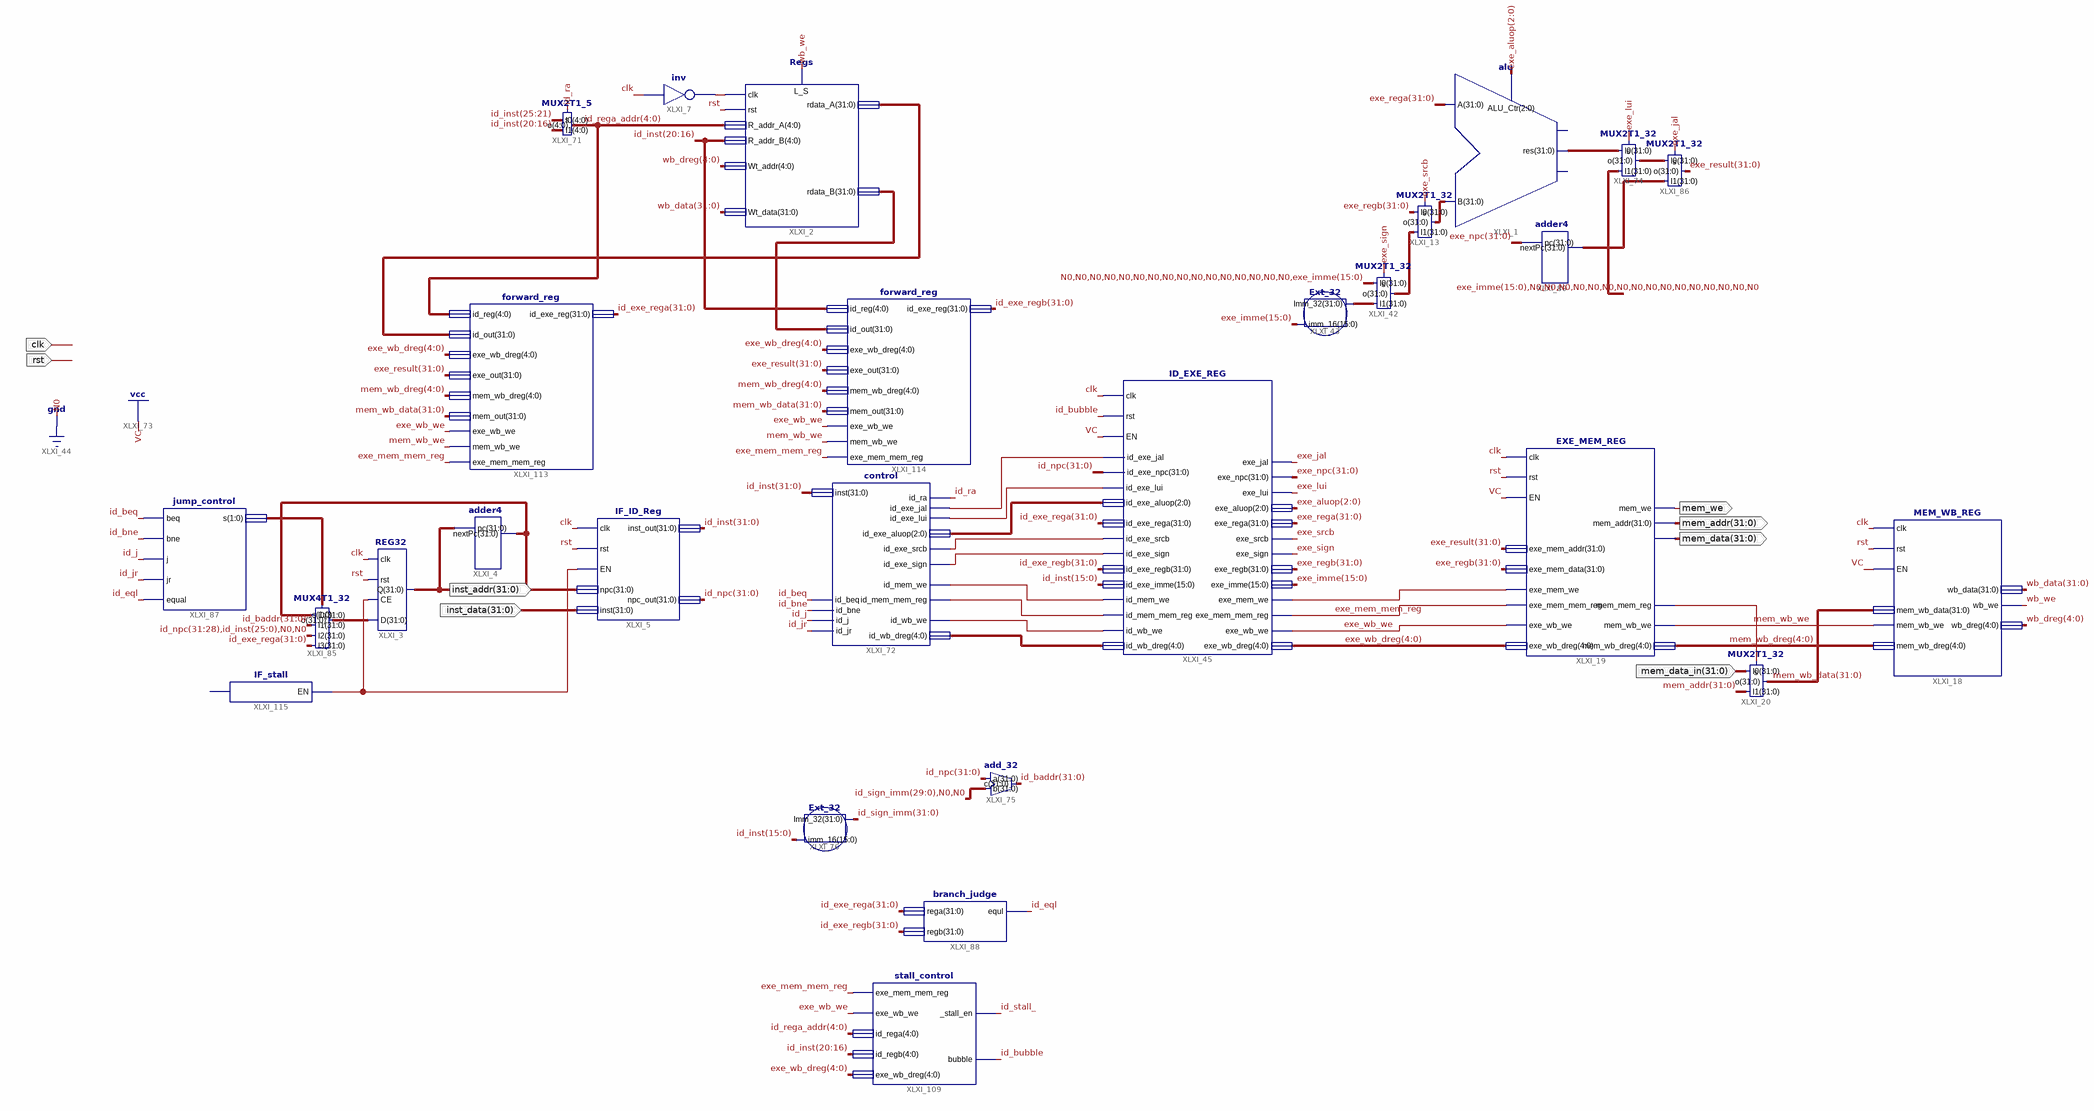
[diagram p0: schematic sheet 1]
// Xilinx ISE schematic PCPU.sch (kintex7) as structural Verilog: 27 symbols, 8 ports
module PCPU (
  input  clk,
  input  rst,
  input  [31:0] inst_data,
  input  [31:0] mem_data_in,
  output mem_we,
  output [31:0] mem_addr,
  output [31:0] mem_data,
  output [31:0] inst_addr
);

  wire exe_jal, exe_lui, exe_mem_mem_reg, exe_sign, exe_srcb, exe_wb_we, id_beq, id_bne, id_bubble, id_eql,
       id_j, id_jr, id_ra, id_stall_, mem_wb_we, wb_we, XLXN_27, XLXN_143, XLXN_246, XLXN_358, XLXN_362,
       XLXN_363, XLXN_365, XLXN_366, XLXN_382, XLXN_426, XLXN_542;
  wire [1:0] XLXN_427;
  wire [2:0] exe_aluop, XLXN_355;
  wire [4:0] exe_wb_dreg, id_rega_addr, mem_wb_dreg, wb_dreg, XLXN_361;
  wire [15:0] exe_imme;
  wire [31:0] exe_npc, exe_rega, exe_regb, exe_result, id_baddr, id_exe_rega, id_exe_regb, id_inst, id_npc,
       id_sign_imm, mem_wb_data, wb_data, XLXN_68, XLXN_221, XLXN_222, XLXN_381, XLXN_408, XLXN_412,
       XLXN_415, XLXN_430, XLXN_538, XLXN_540;

  MEM_WB_REG XLXI_18 (
    .wb_we(wb_we), .mem_wb_we(mem_wb_we), .mem_wb_dreg(mem_wb_dreg), .mem_wb_data(mem_wb_data),
    .wb_dreg(wb_dreg), .wb_data(wb_data), .clk(clk), .rst(rst), .EN(1'b1));
  EXE_MEM_REG XLXI_19 (
    .mem_mem_reg(XLXN_143), .mem_wb_we(mem_wb_we), .mem_wb_dreg(mem_wb_dreg), .mem_we(mem_we),
    .mem_addr(mem_addr), .mem_data(mem_data), .exe_mem_mem_reg(exe_mem_mem_reg), .exe_wb_we(exe_wb_we),
    .exe_wb_dreg(exe_wb_dreg), .clk(clk), .rst(rst), .EN(1'b1), .exe_mem_addr(exe_result),
    .exe_mem_data(exe_regb), .exe_mem_we(XLXN_246));
  MUX2T1_32 XLXI_20 (.s(XLXN_143), .I0(mem_data_in), .I1(mem_addr), .o(mem_wb_data));
  alu XLXI_1 (.ALU_Ctr(exe_aluop), .res(XLXN_381), .A(exe_rega), .B(XLXN_68));  // open: zero, overflow
  MUX2T1_32 XLXI_13 (.s(exe_srcb), .I0(exe_regb), .I1(XLXN_221), .o(XLXN_68));
  MUX2T1_32 XLXI_42 (.s(exe_sign), .I0({{16{1'b0}}, exe_imme}), .I1(XLXN_222), .o(XLXN_221));
  Ext_32 XLXI_43 (.imm_16(exe_imme), .Imm_32(XLXN_222));
  REG32 XLXI_3 (.D(XLXN_408), .CE(XLXN_542), .rst(rst), .clk(clk), .Q(inst_addr));
  adder4 XLXI_4 (.pc(inst_addr), .nextPc(XLXN_412));
  control XLXI_72 (
    .inst(id_inst), .id_wb_dreg(XLXN_361), .id_wb_we(XLXN_366), .id_exe_srcb(XLXN_362),
    .id_exe_sign(XLXN_363), .id_exe_aluop(XLXN_355), .id_mem_mem_reg(XLXN_365), .id_mem_we(XLXN_358),
    .id_exe_lui(XLXN_382), .id_exe_jal(XLXN_426), .id_ra(id_ra), .id_beq(id_beq), .id_bne(id_bne),
    .id_j(id_j), .id_jr(id_jr));
  MUX2T1_32 XLXI_74 (.s(exe_lui), .I0(XLXN_381), .I1({exe_imme, {16{1'b0}}}), .o(XLXN_415));
  MUX4T1_32 XLXI_85 (
    .s(XLXN_427), .I0(XLXN_412), .I1(id_baddr), .I2({id_npc[31:28], id_inst[25:0], 2'b00}), .I3(id_exe_rega),
    .o(XLXN_408));
  MUX2T1_32 XLXI_86 (.s(exe_jal), .I0(XLXN_415), .I1(XLXN_430), .o(exe_result));
  ID_EXE_REG XLXI_45 (
    .id_exe_sign(XLXN_363), .id_exe_srcb(XLXN_362), .id_mem_we(XLXN_358), .id_mem_mem_reg(XLXN_365),
    .id_wb_we(XLXN_366), .id_exe_aluop(XLXN_355), .id_exe_rega(id_exe_rega), .id_exe_regb(id_exe_regb),
    .id_exe_imme(id_inst[15:0]), .id_wb_dreg(XLXN_361), .exe_sign(exe_sign), .exe_srcb(exe_srcb),
    .exe_mem_we(XLXN_246), .exe_mem_mem_reg(exe_mem_mem_reg), .exe_wb_we(exe_wb_we), .exe_aluop(exe_aluop),
    .exe_rega(exe_rega), .exe_regb(exe_regb), .exe_imme(exe_imme), .exe_wb_dreg(exe_wb_dreg),
    .exe_lui(exe_lui), .id_exe_lui(XLXN_382), .exe_npc(exe_npc), .exe_jal(exe_jal), .clk(clk),
    .rst(id_bubble), .EN(1'b1), .id_exe_jal(XLXN_426), .id_exe_npc(id_npc));
  jump_control XLXI_87 (.beq(id_beq), .bne(id_bne), .j(id_j), .jr(id_jr), .equal(id_eql), .s(XLXN_427));
  adder4 XLXI_89 (.pc(exe_npc), .nextPc(XLXN_430));
  Regs XLXI_2 (
    .clk(XLXN_27), .L_S(wb_we), .rdata_A(XLXN_538), .rst(rst), .Wt_data(wb_data), .rdata_B(XLXN_540),
    .R_addr_A(id_rega_addr), .R_addr_B(id_inst[20:16]), .Wt_addr(wb_dreg));
  not XLXI_7 (XLXN_27, clk);
  MUX2T1_5 XLXI_71 (.I1(id_inst[20:16]), .I0(id_inst[25:21]), .o(id_rega_addr), .s(id_ra));
  IF_ID_Reg XLXI_5 (
    .rst(rst), .EN(XLXN_542), .inst_out(id_inst), .clk(clk), .npc(XLXN_412), .inst(inst_data),
    .npc_out(id_npc));
  forward_reg XLXI_113 (
    .exe_wb_dreg(exe_wb_dreg), .exe_out(exe_result), .mem_wb_dreg(mem_wb_dreg), .mem_out(mem_wb_data),
    .id_out(XLXN_538), .id_reg(id_rega_addr), .exe_wb_we(exe_wb_we), .mem_wb_we(mem_wb_we),
    .exe_mem_mem_reg(exe_mem_mem_reg), .id_exe_reg(id_exe_rega));
  forward_reg XLXI_114 (
    .exe_wb_dreg(exe_wb_dreg), .exe_out(exe_result), .mem_wb_dreg(mem_wb_dreg), .mem_out(mem_wb_data),
    .id_out(XLXN_540), .id_reg(id_inst[20:16]), .exe_wb_we(exe_wb_we), .mem_wb_we(mem_wb_we),
    .exe_mem_mem_reg(exe_mem_mem_reg), .id_exe_reg(id_exe_regb));
  IF_stall XLXI_115 (.EN(XLXN_542));  // open: id_stall_
  add_32 XLXI_75 (.b({id_sign_imm[29:0], 2'b00}), .a(id_npc), .c(id_baddr));
  Ext_32 XLXI_76 (.imm_16(id_inst[15:0]), .Imm_32(id_sign_imm));
  branch_judge XLXI_88 (.rega(id_exe_rega), .regb(id_exe_regb), .equl(id_eql));
  stall_control XLXI_109 (
    .exe_mem_mem_reg(exe_mem_mem_reg), .exe_wb_we(exe_wb_we), .id_rega(id_rega_addr),
    .id_regb(id_inst[20:16]), .exe_wb_dreg(exe_wb_dreg), ._stall_en(id_stall_), .bubble(id_bubble));
endmodule
